# EAGLE design MOTOR (EAGLE 9.6.2)
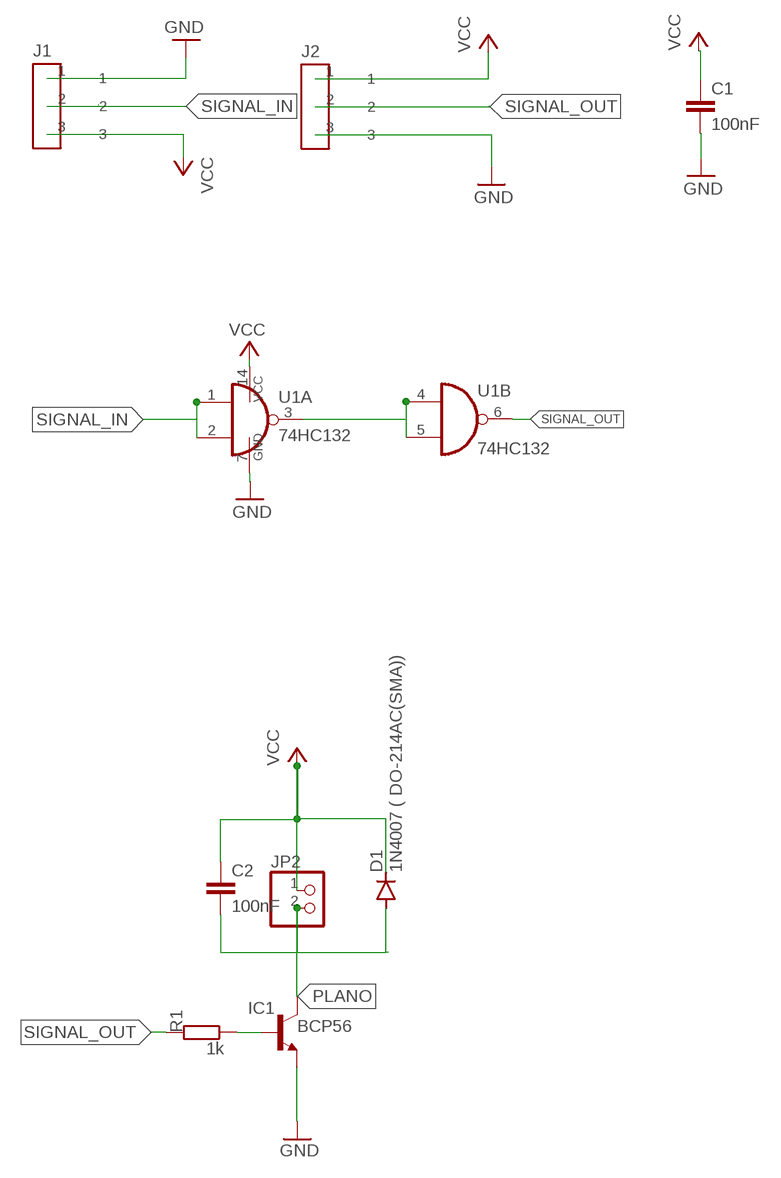
[diagram p0: schematic, sheet 1]

## Parts
C1  100nF  C-EUC0805  [C0805]
C2  100nF  C-EUC0805  [C0805]
D1  1N4007 ( DO-214AC(SMA))  GF1  [SMA-DO214AC]
IC1  BCP56  -NPN-SOT223  [SOT223]
J1  CONECTOR_MACHO  [MALE]
J2  CONECTOR_FEMEA  [FEMALE]
JP2  PINHD-1X2  [1X02]
R1  1k  R-EU_R0805W  [R0805W]
U1  74HC132  74HC00D  [SO14]

## Nets
GND: C1.2 IC1.3(E) J1.1 J2.3 U1.7(P:GND)
N$2: IC1.1(B) R1.1
N$3: U1.3(A:O) U1.4(B:I0) U1.5(B:I1)
PLANO: C2.2 D1.A IC1.4(C) JP2.2
SIGNAL_IN: J1.2 U1.1(A:I0) U1.2(A:I1)
SIGNAL_OUT: J2.2 R1.2 U1.6(B:O)
VCC: C1.1 C2.1 D1.K(C) J1.3 J2.1 JP2.1 U1.14(P:VCC)
Unconnected: U1.8(C:O) U1.9(C:I0) U1.10(C:I1) U1.11(D:O) U1.12(D:I0) U1.13(D:I1)

## Library data of the parts
C1 C2 = rcl:C-EU: CAPACITOR, European symbol; SPICEPREFIX: C
D1 = diode:GF1: DIODE
IC1 = transistor-neu-to92:*-NPN-: NPN Transistror
J1 = Eletroblocks Lib:CONECTOR_MACHO
J2 = Eletroblocks Lib:CONECTOR_FEMEA
JP2 = 1X02:90:PINHD-1X2: PIN HEADER
R1 = rcl:R-EU_: RESISTOR, European symbol; SPICEPREFIX: R
U1 = 74xx-eu:74*00: Quad 2-input NAND gate

## Board
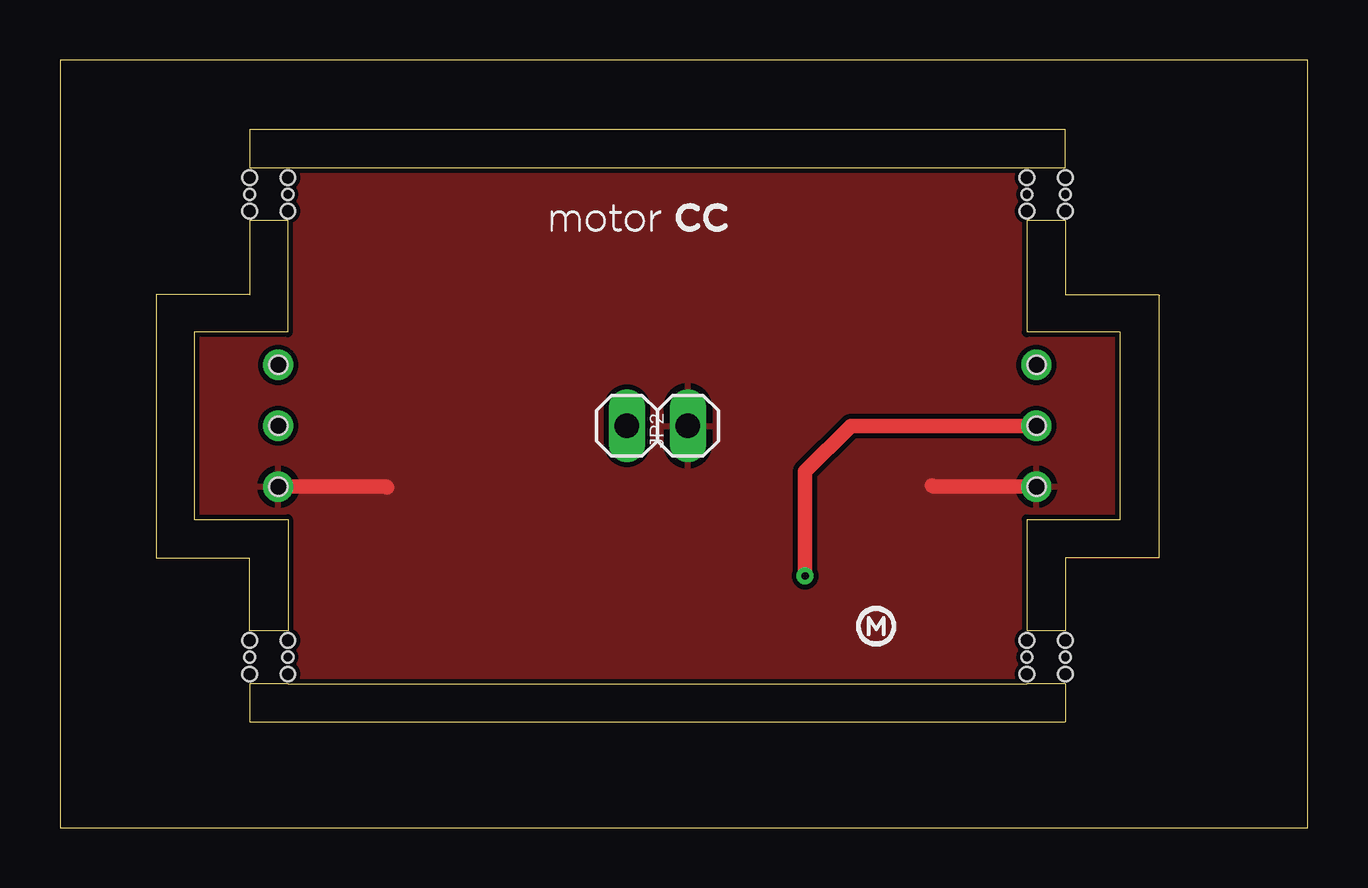
[diagram p1: board, top side]
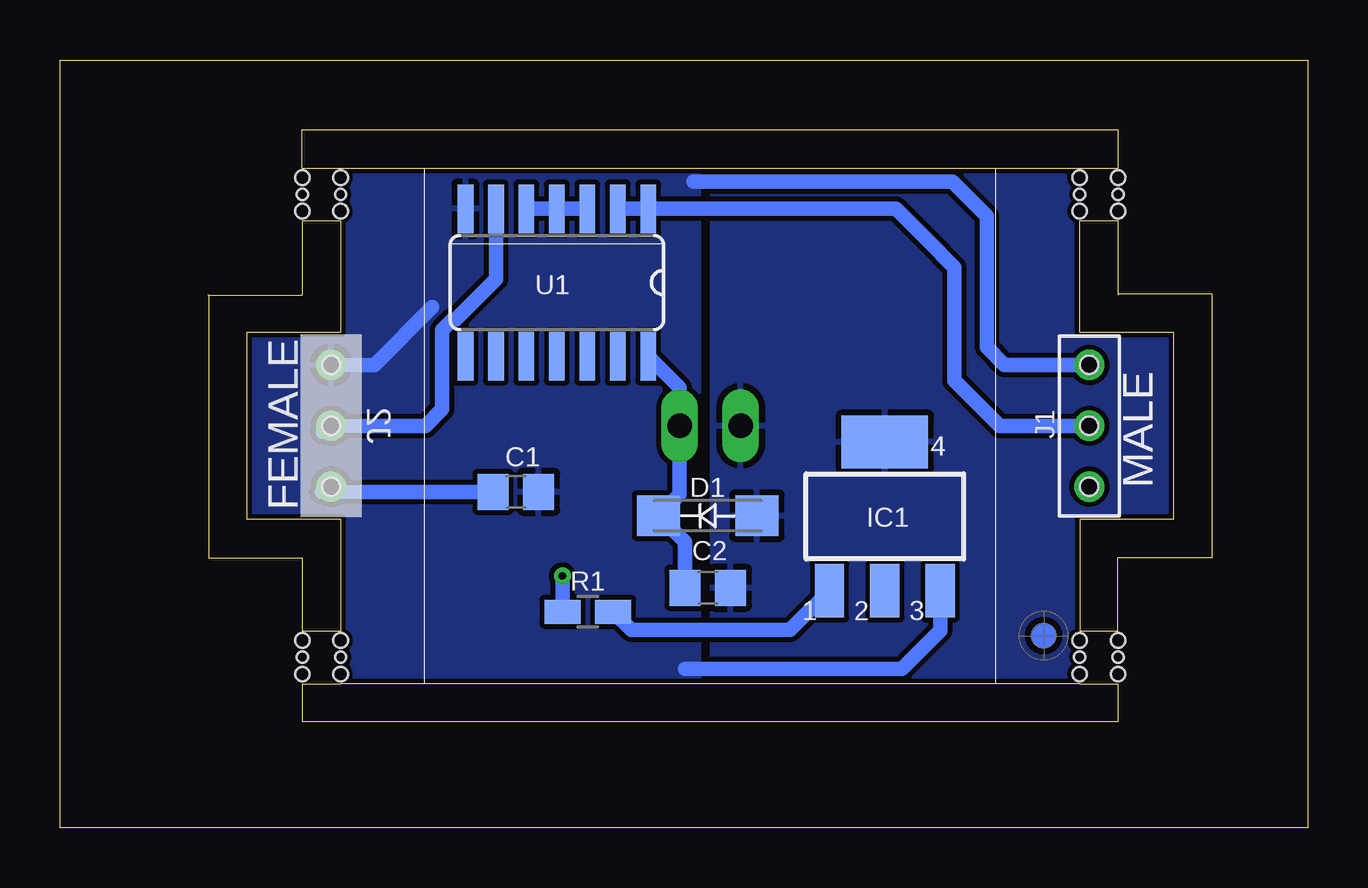
[diagram p2: board, bottom side, seen from below]

Size 52 x 32 mm. Coordinates in mm from the lower left corner, seen from the top.
Outline: 9.5,6 40.3,6
Outline: 40.3,27.5 9.5,27.5
Outline: 7.9,6 7.9,4.4 41.9,4.4 41.9,6
Outline: 7.9,8.2 7.9,11.25 4,11.25 4,22.25 7.9,22.25
Outline: 41.9,8.2 41.9,11.25 45.8,11.25 45.8,22.2
Outline: 45.8,22.2 45.85,22.2
Outline: 41.9,25.3 41.9,22.2 45.8,22.2
Outline: 41.9,27.5 41.9,29.1 7.9,29.1 7.9,27.5
Outline: 7.9,25.3 7.9,22.25
Outline: 7.9,22.25 7.9,22.2
Outline: 9.5,8.2 9.5,12.85 5.6,12.85 5.6,20.65 9.5,20.65 9.5,25.3
Outline: 40.3,25.3 40.3,20.65 44.2,20.65 44.2,12.85 40.3,12.85 40.3,8.2
Outline: 0,32 0,0 52,0 52,32 0,32
Copper layers (1*16): Top 0.035mm / dielectric 1.5mm / Bottom 0.035mm
Design rules "default *": minimum track width 8mil, minimum drill 0.35mm, track to track 8mil, track to pad 8mil, pad to pad 8mil, via to via 8mil, smd to smd 8mil, copper to edge 8mil, drill to drill 8mil, minimum pad ring 10mil, minimum via ring 8mil, stop-mask expansion 4mil, vias tented up to drill 3mm, thermal gap 10mil

### Footprints (pad centres in the part's own frame; a part is rotated, then mirrored left to right if it is on the bottom)
C0805 = smd 1.3 x 1.5: 1 -0.95,0; 2 0.95,0
SMA-DO214AC = smd 1.8 x 1.7: A -2.05,0; K 2.05,0
SOT223 = smd 1.219 x 2.235: 1 -2.311,-3.099; 2 0,-3.099; 3 2.311,-3.099 | smd 3.6 x 2.2: 4 0,3.099
MALE = drill 0.75: 1 0,2.54; 2 0,0; 3 0,-2.54 | hole 0.75: 0,2.54; 0,0; 0,-2.54
FEMALE = drill 0.75: 1 0,2.54; 2 0,0; 3 0,-2.54 | hole 0.75: 0,2.54; 0,0; 0,-2.54
1X02 = drill 1.016 long: 1 -1.27,0; 2 1.27,0
R0805W = smd 1.5 x 1: 1 -1.052,0; 2 1.052,0
SO14 = smd 0.66 x 2.032: 1 -3.81,-3.073; 2 -2.54,-3.073; 3 -1.27,-3.073; 4 0,-3.073; 5 1.27,-3.073; 6 2.54,-3.073; 7 3.81,-3.073; 8 3.81,3.073; 9 2.54,3.073; 10 1.27,3.073; 11 0,3.073; 12 -1.27,3.073; 13 -2.54,3.073; 14 -3.81,3.073
STAMP_DUPLO = hole 0.45: 0,0; 0,-1.6 | hole 0.6: 0.7,0; -0.7,0; 0.7,-1.6; -0.7,-1.6

### Placement (x,y rotation side)
C1  33,14 0 bottom
C2  25,10 0 bottom
D1  25,13 180 bottom
IC1  17.62,12.97 0 bottom
J1  9.1,16.75 0 top
J2  40.7,16.75 180 top
JP2  24.9,16.75 180 top
R1  30,9 180 bottom
U1  31.29,22.72 180 bottom
U$1  [FIDUCIAL_G10]  11,8 0 bottom
U$2  [STAMP_DUPLO]  9.5,7.1 270 top
U$3  [STAMP_DUPLO]  9.5,26.4 270 top
U$4  [STAMP_DUPLO]  41.9,26.4 270 top
U$5  [STAMP_DUPLO]  41.9,7.1 270 top

### Tracks (layer width: path | path; a pad name or v marks a point on that pad's centre or on a via)
GND
  Bottom 0.61: IC1.3 15.31,8.21 16.91,6.61 25.94,6.61 | J1.1 12.63,19.29 13.37,20.03 13.37,25.5 14.8,26.93 25.6,26.93 | J2.3 38.89,19.29 36.49,21.69
  pour Bottom: 25.39,6 44.8,6 44.8,27.5 25.39,27.5
N$2
  Bottom 0.61: IC1.1 21.56,8.24 28.19,8.24 R1.1
N$3
  Bottom 0.61: U1.3 U1.4 U1.5
PLANO
  pour Bottom: 5,6 5,27.44 24.84,27.44 24.84,6
SIGNAL_IN
  Bottom 0.61: J1.2 12.82,16.75 14.71,18.64 14.71,23.34 15.85,24.48 17.16,25.79 U1.1 27.88,25.79 U1.2
SIGNAL_OUT  (via drill 0.3)
  Top 0.61: v31.06,10.49 31.06,14.85 32.96,16.75 J2.2
  Bottom 0.61: 41.05,16.5 J2.2 36.76,16.75 36.07,17.44 36.07,20.74 35.64,21.17 35.52,21.17 33.83,22.86 U1.6 | R1.2 v31.05,10.48 v31.06,10.49
VCC
  Top 0.61: J1.3 13.6,14.21 13.63,14.18 | J2.1 36.4,14.21 36.34,14.27
  Bottom 0.61: C2.1 25.95,11.9 D1.K 26.17,13.88 JP2.1 26.17,18.34 U1.14 | C1.1 40.13,14 | 40.13,14 40.14,13.99 | J2.1 41.09,14 40.13,14
  pour Top: 5,6 5,27.41 44.86,27.41 44.86,6.05 5.05,6.05

### Text on the board
tStop: V1.0.2
bStop: V1.0.2